# EAGLE design cummins_controller_V1.4 (EAGLE 9.3.0)
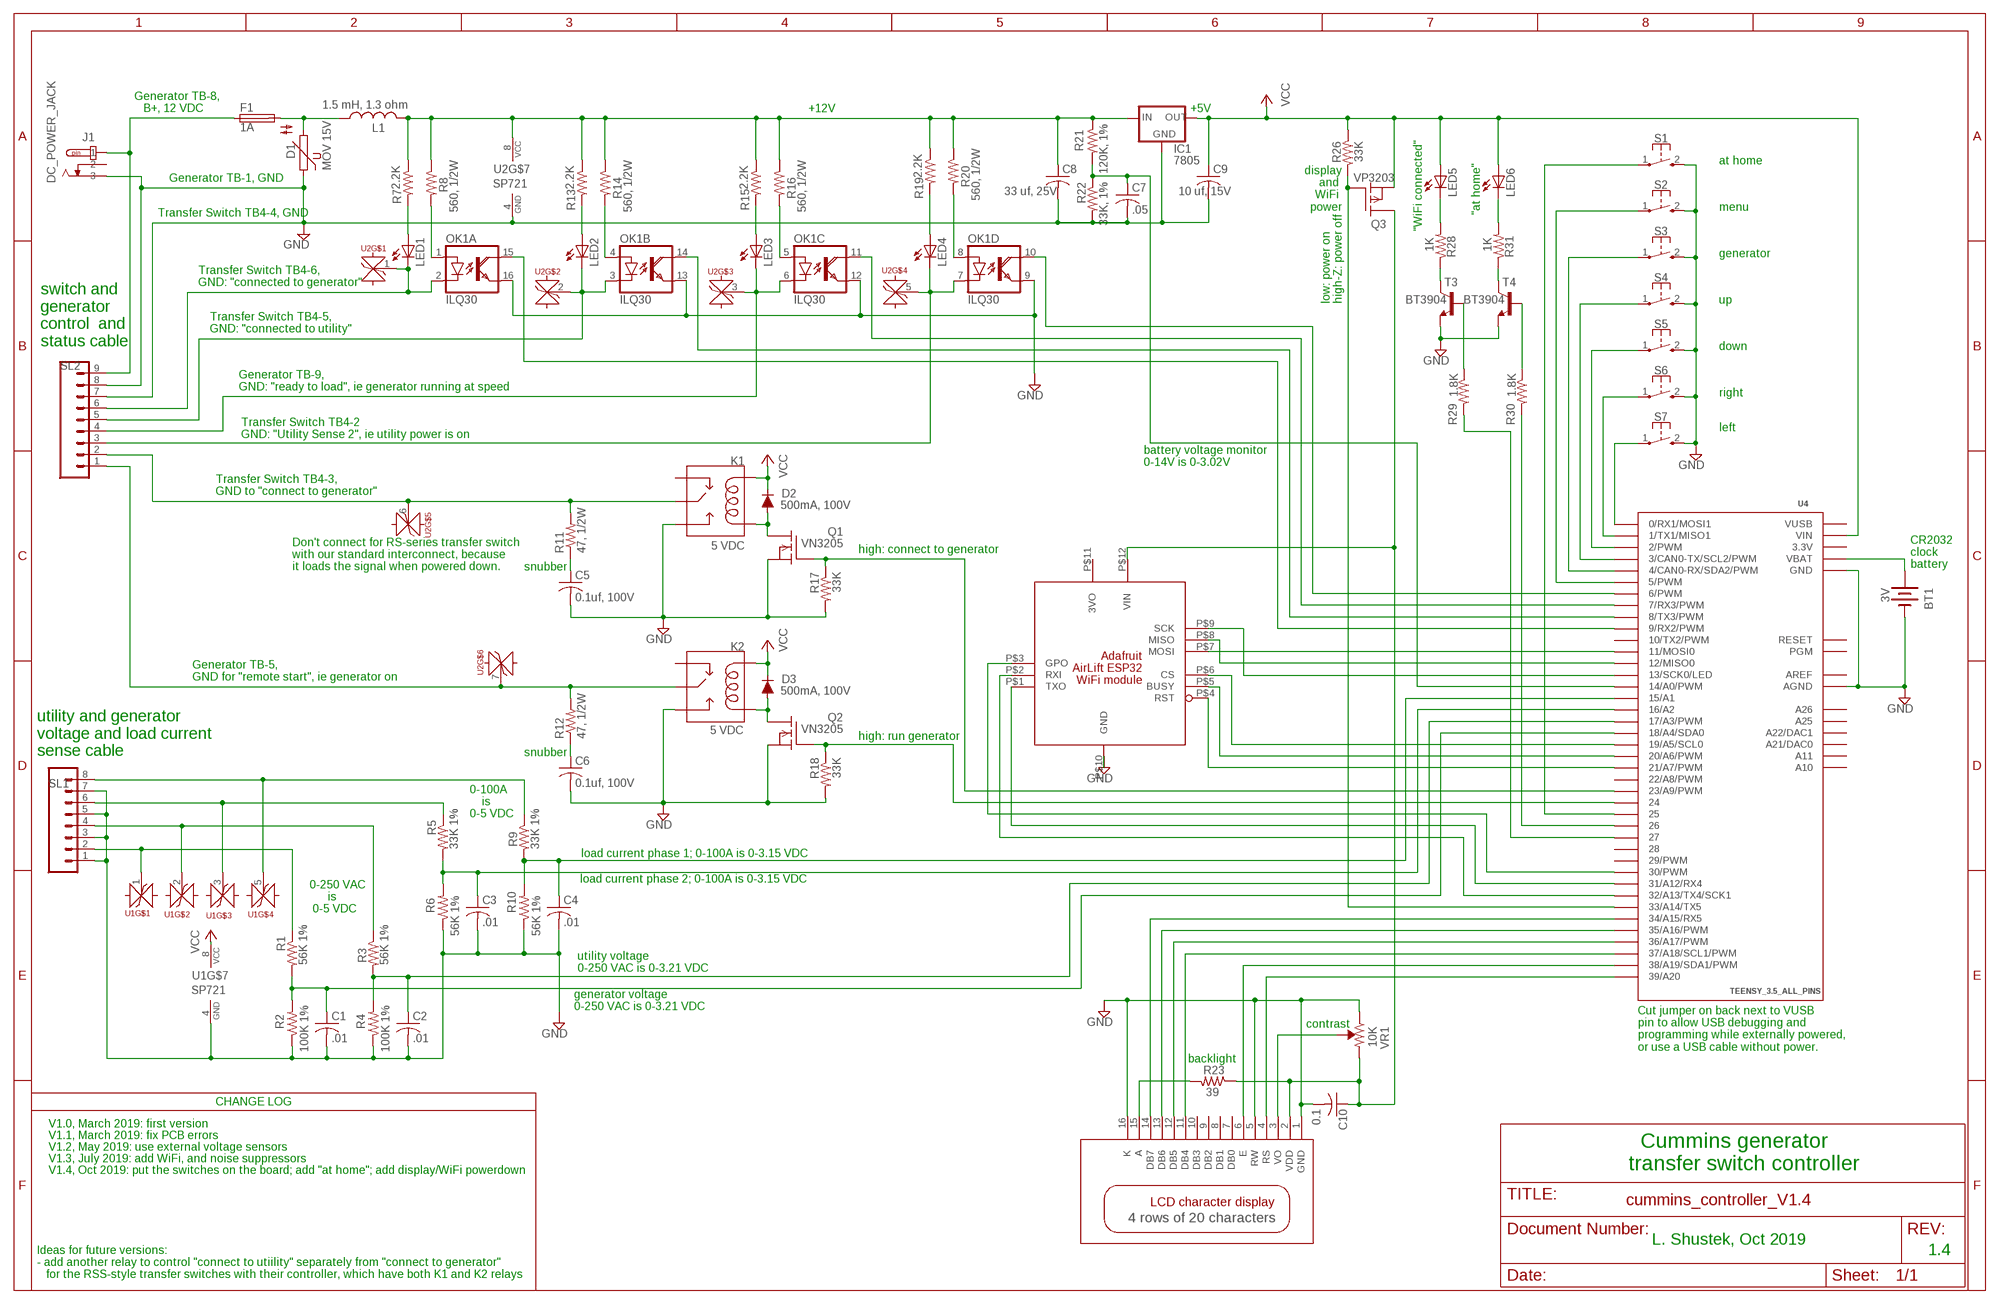
[diagram p0: schematic, sheet 1]

## Parts
BT1  3V  BATTERY-20MM_PTH  [BATTCOM_20MM_PTH]
C1  .01  C-USC0805K  [C0805K]
C2  .01  C-USC0805K  [C0805K]
C3  .01  C-USC0805K  [C0805K]
C4  .01  C-USC0805K  [C0805K]
C5  0.1uf, 100V  C-USC1210K  [C1210K]
C6  0.1uf, 100V  C-USC1210K  [C1210K]
C7  .05  C-USC0805K  [C0805K]
C8  33 uf, 25V  C-USC3216  [C3216]
C9  10 uf, 15V  C-USC1210K  [C1210K]
C10  0.1  C-USC0805K  [C0805K]
D1  MOV 15V  S14K230  [S14K230]
D2  500mA, 100V  DIODE-BAS16J  [SOD-323]
D3  500mA, 100V  DIODE-BAS16J  [SOD-323]
F1  1A  FUSEPICOFUSE  [PICOFUSE]
IC1  7805  78XXS  [78XXS]
J1  DC_POWER_JACK  [DC_POWER_JACK]
K1  5 VDC  RELAY-SPDT-V2  [RELAY-PANASONIC-JS]
K2  5 VDC  RELAY-SPDT-V2  [RELAY-PANASONIC-JS]
L1  1.5 mH, 1.3 ohm  INDUCTOR  [INDUCTOR_1.1IN]
LED1  LED5MM  [LED5MM]
LED2  LED5MM  [LED5MM]
LED3  LED5MM  [LED5MM]
LED4  LED5MM  [LED5MM]
LED5  LED5MM  [LED5MM]
LED6  LED5MM  [LED5MM]
OK1  ILQ30  [DIL16]
Q1  VN3205  VN3205SOT89  [SOT89]
Q2  VN3205  VN3205SOT89  [SOT89]
Q3  VP3203  VP3203SOP89  [SOT89]
R1  56K 1%  R-US_M1206  [M1206]
R2  100K 1%  R-US_M1206  [M1206]
R3  56K 1%  R-US_M1206  [M1206]
R4  100K 1%  R-US_M1206  [M1206]
R5  33K 1%  R-US_M1206  [M1206]
R6  56K 1%  R-US_M1206  [M1206]
R7  2.2K  R-US_M1206  [M1206]
R8  560, 1/2W  R-US_R1210  [R1210]
R9  33K 1%  R-US_M1206  [M1206]
R10  56K 1%  R-US_M1206  [M1206]
R11  47, 1/2W  R-US_R1210  [R1210]
R12  47, 1/2W  R-US_R1210  [R1210]
R13  2.2K  R-US_M1206  [M1206]
R14  560, 1/2W  R-US_R1210W  [R1210W]
R15  2.2K  R-US_M1206  [M1206]
R16  560, 1/2W  R-US_R1210  [R1210]
R17  33K  R-US_M1206  [M1206]
R18  33K  R-US_M1206  [M1206]
R19  2.2K  R-US_M1206  [M1206]
R20  560, 1/2W  R-US_R1210  [R1210]
R21  120K, 1%  R-US_M1206  [M1206]
R22  33K, 1%  R-US_M1206  [M1206]
R23  39  R-US_M1206  [M1206]
R26  33K  R-US_M1206  [M1206]
R28  1K  R-US_M1206  [M1206]
R29  1.8K  R-US_M1206  [M1206]
R30  1.8K  R-US_M1206  [M1206]
R31  1K  R-US_M1206  [M1206]
S1  PUSHBUTTON-SPST  [PUSHBUTTON-SPST]
S2  PUSHBUTTON-SPST  [PUSHBUTTON-SPST]
S3  PUSHBUTTON-SPST  [PUSHBUTTON-SPST]
S4  PUSHBUTTON-SPST  [PUSHBUTTON-SPST]
S5  PUSHBUTTON-SPST  [PUSHBUTTON-SPST]
S6  PUSHBUTTON-SPST  [PUSHBUTTON-SPST]
S7  PUSHBUTTON-SPST  [PUSHBUTTON-SPST]
SL1  M08  [08P]
SL2  M09  [09P]
T3  BT3904  NPN-TRANSISTORSOT23-3  [SOT23-3]
T4  BT3904  NPN-TRANSISTORSOT23-3  [SOT23-3]
U1  SP721  TVS_DIODE_ARRAY  [TVS_6DIODE_ARRAY]
U2  SP721  TVS_DIODE_ARRAY  [TVS_6DIODE_ARRAY]
U3  ADAFRUIT_AIRLIFT_ESP32  [ADAFRUIT_AIRLIFT_ESP32]
U4  TEENSY_3.5_ALL_PINS  [TEENSY_3.5_ALL_PINS]
VR1  10K  TRIMPOT  [TRIMBOT-BOURNS-3362M]
X1  4 rows of 20 characters  LCD-CHARACTER-DISPLAY  [LCD-CHARACTER-DISPLAY-20X4]

## Nets
GND [power]: BT1.2(-) C1.2 C2.2 C3.2 C4.2 C5.2 C6.2 C7.2 C8.2 C9.2 C10.2 D1.1 IC1.GND J1.P$5 K1.P$3(NO) K2.P$3(NO) OK1.9(D:EMI) OK1.12(C:EMI) OK1.13(B:EMI) OK1.16(A:EMI) Q1.3(S) Q2.3(S) R2.1 R4.1 R6.1 R10.1 R17.2 R18.2 R22.2 S1.2 S2.2 S3.2 S4.2 S5.2 S6.2 S7.2 SL1.1 SL1.3 SL1.5 SL1.7 SL2.7 SL2.8 T3.2(E) T4.2(E) U1.4(GND) U2.4(GND) U3.P$10(GND) U4.AGND U4.GND U4.GND1(GND) U4.GND3(GND) U4.GND4(GND) U4.GND6(GND) VR1.3(CW) X1.1(GND) X1.5(RW) X1.16(K)
N$1: BT1.1(+) U4.VBAT
N$2 [power]: D2.A K1.P$5(COIL2) Q1.2(D) Q1.2@1(D)
N$3: S7.1 U4.0(0/RX1/MOSI1)
N$4: LED1.A R7.2
N$5: R9.1 SL1.8 U1.5
N$6 [power]: D3.A K2.P$5(COIL2) Q2.2(D) Q2.2@1(D)
N$7: U3.P$1(TXO) U4.31/A12(31/A12/RX4)
N$8 [power]: LED2.K(C) OK1.3(B:C) SL2.5 U2.2
N$9 [power]: F1.1 J1.P$1 SL2.9
N$10: LED2.A R13.2
N$11 [power]: K2.P$1(MAIN) R12.2 SL2.1 U2.7
N$12 [power]: K1.P$1(MAIN) R11.2 SL2.2 U2.6
N$13: LED3.A R15.2
N$14: Q2.1(G) R18.1 U4.24
N$15: C4.1 R9.2 R10.2 U4.15/A1
N$16: R5.1 SL1.6 U1.3
N$17: C3.1 R5.2 R6.2 U4.16/A2
N$18: R3.1 SL1.4 U1.2
N$19: C2.1 R3.2 R4.2 U4.17/A3(17/A3/PWM)
N$20: LED4.A R19.2
N$21: OK1.5(C:A) R16.2
N$22: R1.1 SL1.2 U1.1
N$23: R30.1 T4.1(B)
N$24 [power]: LED1.K(C) OK1.2(A:C) SL2.6 U2.1
N$25: C1.1 R1.2 R2.2 U4.18/A4(18/A4/SDA0)
N$26: U3.P$9(SCK) U4.13(13/SCK0/LED)
N$27: U3.P$8(MISO) U4.12(12/MISO0)
N$28: U3.P$7(MOSI) U4.11(11/MOSI0)
N$29: U3.P$6(CS) U4.19/A5(19/A5/SCL0)
N$30: U3.P$5(BUSY) U4.20/A6(20/A6/PWM)
N$31: U3.P$4(RST) U4.21/A7(21/A7/PWM)
N$32: U3.P$2(RXI) U4.32/A13(32/A13/TX4/SCK1)
N$33: U4.34/A15(34/A15/RX5) X1.14(DB7)
N$34: R31.1 T4.3(C)
N$35: U4.39/A20 X1.4(RS)
N$36: U4.38/A19(38/A19/SDA1/PWM) X1.6(E)
N$37 [power]: LED3.K(C) OK1.6(C:C) SL2.4 U2.3
N$38: U4.37/A18(37/A18/SCL1/PWM) X1.11(DB4)
N$39: U4.36/A17(36/A17/PWM) X1.12(DB5)
N$40: U4.35/A16(35/A16/PWM) X1.13(DB6)
N$41: Q1.1(G) R17.1 U4.23/A9(23/A9/PWM)
N$42 [power]: C8.1 IC1.IN L1.P$2 R7.1 R8.1 R13.1 R14.1 R15.1 R16.1 R19.1 R20.1 R21.1 U2.8(VCC)
N$43: S6.1 U4.1(1/TX1/MISO1)
N$44: S5.1 U4.2(2/PWM)
N$45: S4.1 U4.3(3/CAN0-TX/SCL2/PWM)
N$46: S3.1 U4.4(4/CAN0-RX/SDA2/PWM)
N$47: S2.1 U4.5(5/PWM)
N$48: VR1.2(WIPER) X1.3(VO)
N$49: R23.2 X1.15(A)
N$50: S1.1 U4.25
N$51: LED5.K(C) R28.2
N$52 [power]: OK1.10(D:COL) U4.6(6/PWM)
N$53 [power]: OK1.11(C:COL) U4.7(7/RX3/PWM)
N$54 [power]: OK1.14(B:COL) U4.8(8/TX3/PWM)
N$55 [power]: OK1.15(A:COL) U4.9(9/RX2/PWM)
N$56: C5.1 R11.1
N$57: C6.1 R12.1
N$58: OK1.1(A:A) R8.2
N$59 [power]: LED4.K(C) OK1.7(D:C) SL2.3 U2.5
N$60: OK1.4(B:A) R14.2
N$61: LED6.K(C) R31.2
N$62: OK1.8(D:A) R20.2
N$63: C7.1 R21.2 R22.1 U4.14/A0(14/A0/PWM)
N$64: Q3.1(G) R26.2 U4.33/A14(33/A14/TX5)
N$65: U3.P$3(GPO) U4.30(30/PWM)
N$66: R29.1 T3.1(B)
N$67: R28.1 T3.3(C)
N$68: R29.2 U4.27
N$70 [power]: D1.2 F1.2 L1.P$1
N$72: R30.2 U4.26
VCC [power]: C9.1 D2.C D3.C IC1.OUT K1.P$2(COIL1) K2.P$2(COIL1) LED5.A LED6.A Q3.3(S) R26.1 U1.8(VCC) U4.VIN
VDD [power]: C10.1 Q3.2(D) Q3.2@1(D) R23.1 U3.P$12(VIN) VR1.1(CCW) X1.2(VDD)
Unconnected: J1.P$3 K1.P$4(NC) K2.P$4(NC) U1.6 U1.7 U3.P$11(3VO) U4.10(10/TX2/PWM) U4.22/A8(22/A8/PWM) U4.28 U4.29(29/PWM) U4.A10 U4.A11 U4.A21(A21/DAC0) U4.A22(A22/DAC1) U4.A25 U4.A26 U4.PGM U4.RESET X1.7(DB0) X1.8(DB1) X1.9(DB2) X1.10(DB3)

## Notes on the sheet
- Generator TB-8,
     B+, 12 VDC
- +12V | +5V
- "WiFi connected"
- "at home" | at home
- Generator TB-1, GND
- display
   and 
  WiFi 
  power
- menu
- Transfer Switch TB4-4, GND
- generator
- Transfer Switch TB4-6, 
  GND: "connected to generator"
- low: power on
  high-Z: power off
- up
- Transfer Switch TB4-5, 
  GND: "connected to utility"
- switch and 
  generator
  control  and
  status cable
- down
- Generator TB-9,
  GND: "ready to load", ie generator running at speed
- right
- left
- Transfer Switch TB4-2
  GND: "Utility Sense 2", ie utility power is on
- battery voltage monitor
  0-14V is 0-3.02V
- Transfer Switch TB4-3, 
  GND to "connect to generator"
- high: connect to generator
- CR2032
  clock
  battery
- Don't connect for RS-series transfer switch
  with our standard interconnect, because
  it loads the signal when powered down.
- snubber
- Generator TB-5,
  GND for "remote start", ie generator on
- high: run generator
- utility and generator
  voltage and load current
  sense cable
- snubber
- 0-100A
      is 
  0-5 VDC
- load current phase 1; 0-100A is 0-3.15 VDC
- load current phase 2; 0-100A is 0-3.15 VDC
- 0-250 VAC
        is 
   0-5 VDC
- utility voltage
  0-250 VAC is 0-3.21 VDC
- generator voltage
  0-250 VAC is 0-3.21 VDC
- contrast
- Cut jumper on back next to VUSB
  pin to allow USB debugging and 
  programming while externally powered,
  or use a USB cable without power.
- backlight
- CHANGE LOG
- V1.0, March 2019: first version
- V1.1, March 2019: fix PCB errors
- V1.2, May 2019: use external voltage sensors
- V1.3, July 2019: add WiFi, and noise suppressors
- Cummins generator 
  transfer switch controller
- V1.4, Oct 2019: put the switches on the board; add "at home"; add display/WiFi powerdown
- L. Shustek, Oct 2019
- 1.4
- Ideas for future versions:
  - add another relay to control "connect to utiility" separately from "connect to generator"
     for the RSS-style transfer switches with their controller, which have both K1 and K2 relays

## Power pins joined to a net without a drawn wire
3.3V: U4.3.3V U4.3.3V3(3.3V) U4.3.3V4(3.3V)
AREF: U4.AREF
VUSB: U4.VUSB

## Library data of the parts
BT1 = SparkFun-Batteries:BATTERY: Battery - Single Cell A variety of battery chemistries, sizes, and footprints. Device List: 20MM_PTH - Coin Cell Battery Holder - 20mm (PTH) <https://www.sparkfun.com/products/783> 6.8MM_PTH - Coin Cell Battery Holder - 6.8MM(SMD) <https://www.digikey.com/product-detail/en/seiko-instruments/MS621FE-FL11E/728-1057-ND/1889208?WT.srch=1&gclid=CNOQ5a6LzdQCFZS2wAodXCkE0g> 12MM_SMD - Coin Cell Battery Holder - 12mm (SMD) <https://www.sparkfun.com/products/10592> 12MM_PTH - Coin Cell Battery Holder - 12mm (PTH) <https://www.sparkfun.com/products/7948> 20MM_SMD - 20mm Coin Cell Battery Holder (SMD) (2 legs) Used on the Big Time Watch Kit <https://www.sparkfun.com/products/11734> 20MM_SMD_4LEGS - Coin Cell Battery Holder - 20mm (SMD) <https://www.sparkfun.com/products/11892> 20MM_SMD_4LEGS_OVERPASTE - Coin Cell Battery Holder - 20mm (SMD) <https://www.sparkfun.com/products/11892> (Over-paste on the legs) 24.5MM_PTH - Coin Cell Battery Holder - 24.5mm (PTH) <https://www.sparkfun.com/products/8863> 9V - 9V Battery Holder - PC Mount Used on the SparkFun SparkPunk Sound Kit <https://www.sparkfun.com/products/11177> and SparkFun SparkPunk Sequencer Kit <https://www.sparkfun.com/products/12707> 18650 - Battery Holder - 18650 (PTH) <https://www.sparkfun.com/products/13113> AA - Battery Holder - 1xAA (PTH) <https://www.sparkfun.com/products/7949> AAA - Battery Holder - 1xAAA (PTH) <https://www.sparkfun.com/products/12718> AA_KIT - Battery Holder - 1xAA (PTH) <https://www.sparkfun.com/products/7949> Special kit package - pads only have exposed copper on one side of the board. AAA_KIT - Battery Holder - 1xAAA (PTH) <https://www.sparkfun.com/products/12718> Special kit package - pads only have exposed copper on one side of the board.; PROD_ID: BATT-09031; SF_SKU: PRT-00783
C1-C4 C7 C10 = adafruit:C-US: CAPACITOR, American symbol
C5 C6 C8 C9 = resistor:C-US: CAPACITOR, American symbol
D1 = varistor:S14K230: VARISTOR
D2 D3 = SparkFun-DiscreteSemi:DIODE: Diode These are standard reverse protection diodes and small signal diodes. SparkFun Products: SparkFun SparkPunk Sound Kit <https://www.sparkfun.com/products/11177> SparkFun ESP8266 Thing <https://www.sparkfun.com/products/13231>; PROD_ID: DIO-09646; VALUE: 250mA/100V
F1 = fuse:FUSE: Fuse; OC_FARNELL: unknown; OC_NEWARK: unknown
IC1 = v-reg:78XXS: VOLTAGE REGULATOR
J1 = Len:DC_POWER_JACK: DC POWER JACK Source: DCJ0202.pdf; OC_FARNELL: unknown; OC_NEWARK: unknown
K1 K2 = Len:RELAY-SPDT-V2: SPDT Electromechanical Relay Single-pole, double-throw sealed relays. When current is applied to the coil, it throws a simple changeover switch, terminating the connection from the NC contact to ground and closing the NO contact. Use them to switch high voltage/high current devices. SparkFun Products JQX-15F: Relay SPDT Sealed - 20A <https://www.sparkfun.com/products/10924> (COM-10924) JZC-11F: Relay SPDT Sealed <https://www.sparkfun.com/products/100> (COM-00100)
L1 = Len:INDUCTOR
LED1-LED6 = adafruit:LED: LED OSRAM: - CHIPLED LG R971, LG N971, LY N971, LG Q971, LY Q971, LO R971, LY R971 LH N974, LH R974 LS Q976, LO Q976, LY Q976 LO Q996 - Hyper CHIPLED LW Q18S LB Q993, LB Q99A, LB R99A - SideLED LS A670, LO A670, LY A670, LG A670, LP A670 LB A673, LV A673, LT A673, LW A673 LH A674 LY A675 LS A676, LA A676, LO A676, LY A676, LW A676 LS A679, LY A679, LG A679 - Hyper Micro SIDELED® LS Y876, LA Y876, LO Y876, LY Y876 LT Y87S - SmartLED LW L88C, LW L88S LB L89C, LB L89S, LG L890 LS L89K, LO L89K, LY L89K LS L896, LA L896, LO L896, LY L896 - TOPLED LS T670, LO T670, LY T670, LG T670, LP T670 LSG T670, LSP T670, LSY T670, LOP T670, LYG T670 LG T671, LOG T671, LSG T671 LB T673, LV T673, LT T673, LW T673 LH T674 LS T676, LA T676, LO T676, LY T676, LB T676, LH T676, LSB T676, LW T676 LB T67C, LV T67C, LT T67C, LS T67K, LO T67K, LY T67K, LW E67C LS E67B, LA E67B, LO E67B, LY E67B, LB E67C, LV E67C, LT E67C LW T67C LS T679, LY T679, LG T679 LS T770, LO T770, LY T770, LG T770, LP T770 LB T773, LV T773, LT T773, LW T773 LH T774 LS E675, LA E675, LY E675, LS T675 LS T776, LA T776, LO T776, LY T776, LB T776 LHGB T686 LT T68C, LB T68C - Hyper Mini TOPLED® LB M676 - Mini TOPLED Santana® LG M470 LS M47K, LO M47K, LY M47K Source: http://www.osram.convergy.de/
OK1 = optocoupler:ILQ30: SIEMENS OPTO COUPLER; MF: VISHAY/TELEFUNKEN; MPN: ILQ30; OC_FARNELL: 1612449; OC_NEWARK: 58K1688
Q1 Q2 = Len:VN3205: N-Channel Enhancement MOSFET 500V, 0.4A, 6.0 Ohm
Q3 = Len:VP3203: P-Channel Enhancement MOSFET (HEXFET); -100V; -12A; 0,3Ohm
R1-R13 R15-R23 R26 R28-R31 = resistor:R-US_: RESISTOR, American symbol
R14 = adafruit:R-US_: RESISTOR, American symbol
S1-S7 = Len:PUSHBUTTON-SPST: Momentary Switch (Pushbutton) - SPST - Two Circuits Normally-open (NO) SPST momentary switches
SL1 = con-amp-quick:M08: AMP QUICK CONNECTOR; OC_FARNELL: unknown; OC_NEWARK: unknown
SL2 = con-amp-quick:M09: AMP QUICK CONNECTOR; OC_FARNELL: unknown; OC_NEWARK: unknown
T3 T4 = Len:NPN-TRANSISTOR
U1 U2 = Len:TVS_DIODE_ARRAY
U3 = Len:ADAFRUIT_AIRLIFT_ESP32: Adafruit AirLink ESP32 WiFi module
U4 = Teensy_3_and_LC_Series_Boards_v1.4:TEENSY_3.5_ALL_PINS: All PIN version of the Teensy 3.5. Note: the NC pin is not shown in symbol package, not connected here either.
VR1 = Len:TRIMPOT: Trimming Potentiometer (Trimpot) Three-terminal potentiometers, with an adjustable wiper and two adjustable resistors. A pot can be used to create a configurable voltage divider, or as a variable resistor. "Trimpots" are a subset of potentiometers, usually intended for "set-and-forget" applications. They're often more delicate than standard potentiometers - rated for fewer turns. Variants PTH-KNOB - PTH Trimpot w/ finger-adjustable knob Trimpot 10K with Knob <https://www.sparkfun.com/products/9806> (COM-09806) Datasheet <http://www.sparkfun.com/datasheets/Components/General/TSR-3386.pdf> SMD-3MM-CLOSED-FRAME - SMD 3mm Square Closed-Frame Trimpot Used on e.g. EasyDriver - Stepper Motor Driver <https://www.sparkfun.com/products/12779> Datasheet <http://www.bitechnologies.com/pdfs/22.pdf> (22AR10KTR) SMD-5MM - SMD 5mm Square Closed-Frame Trimpot Used on e.g. IOIO-OTG - V2.2 <https://www.sparkfun.com/products/13613> Datasheet <http://www.vishay.com/docs/51008/ts53.pdf> (TS53YL502MR10) SMD-3MM-1/10W-25% - 3mm Square Open-Frame Trimpot Used on e.g. SparkFun Shapeoko <https://www.sparkfun.com/products/13899> Datasheet <http://www.bourns.com/docs/Product-Datasheets/TC33.pdf> (TC33X-2-103E)
X1 = Len:LCD-CHARACTER-DISPLAY: HD44780 LCD Standard character type LCDs, available in sizes from 8x1 to 40x4!

## Net classes
0 default: width 0.381 mm
1 power: width 0.508 mm
2 highV: width 0.508 mm

## Board
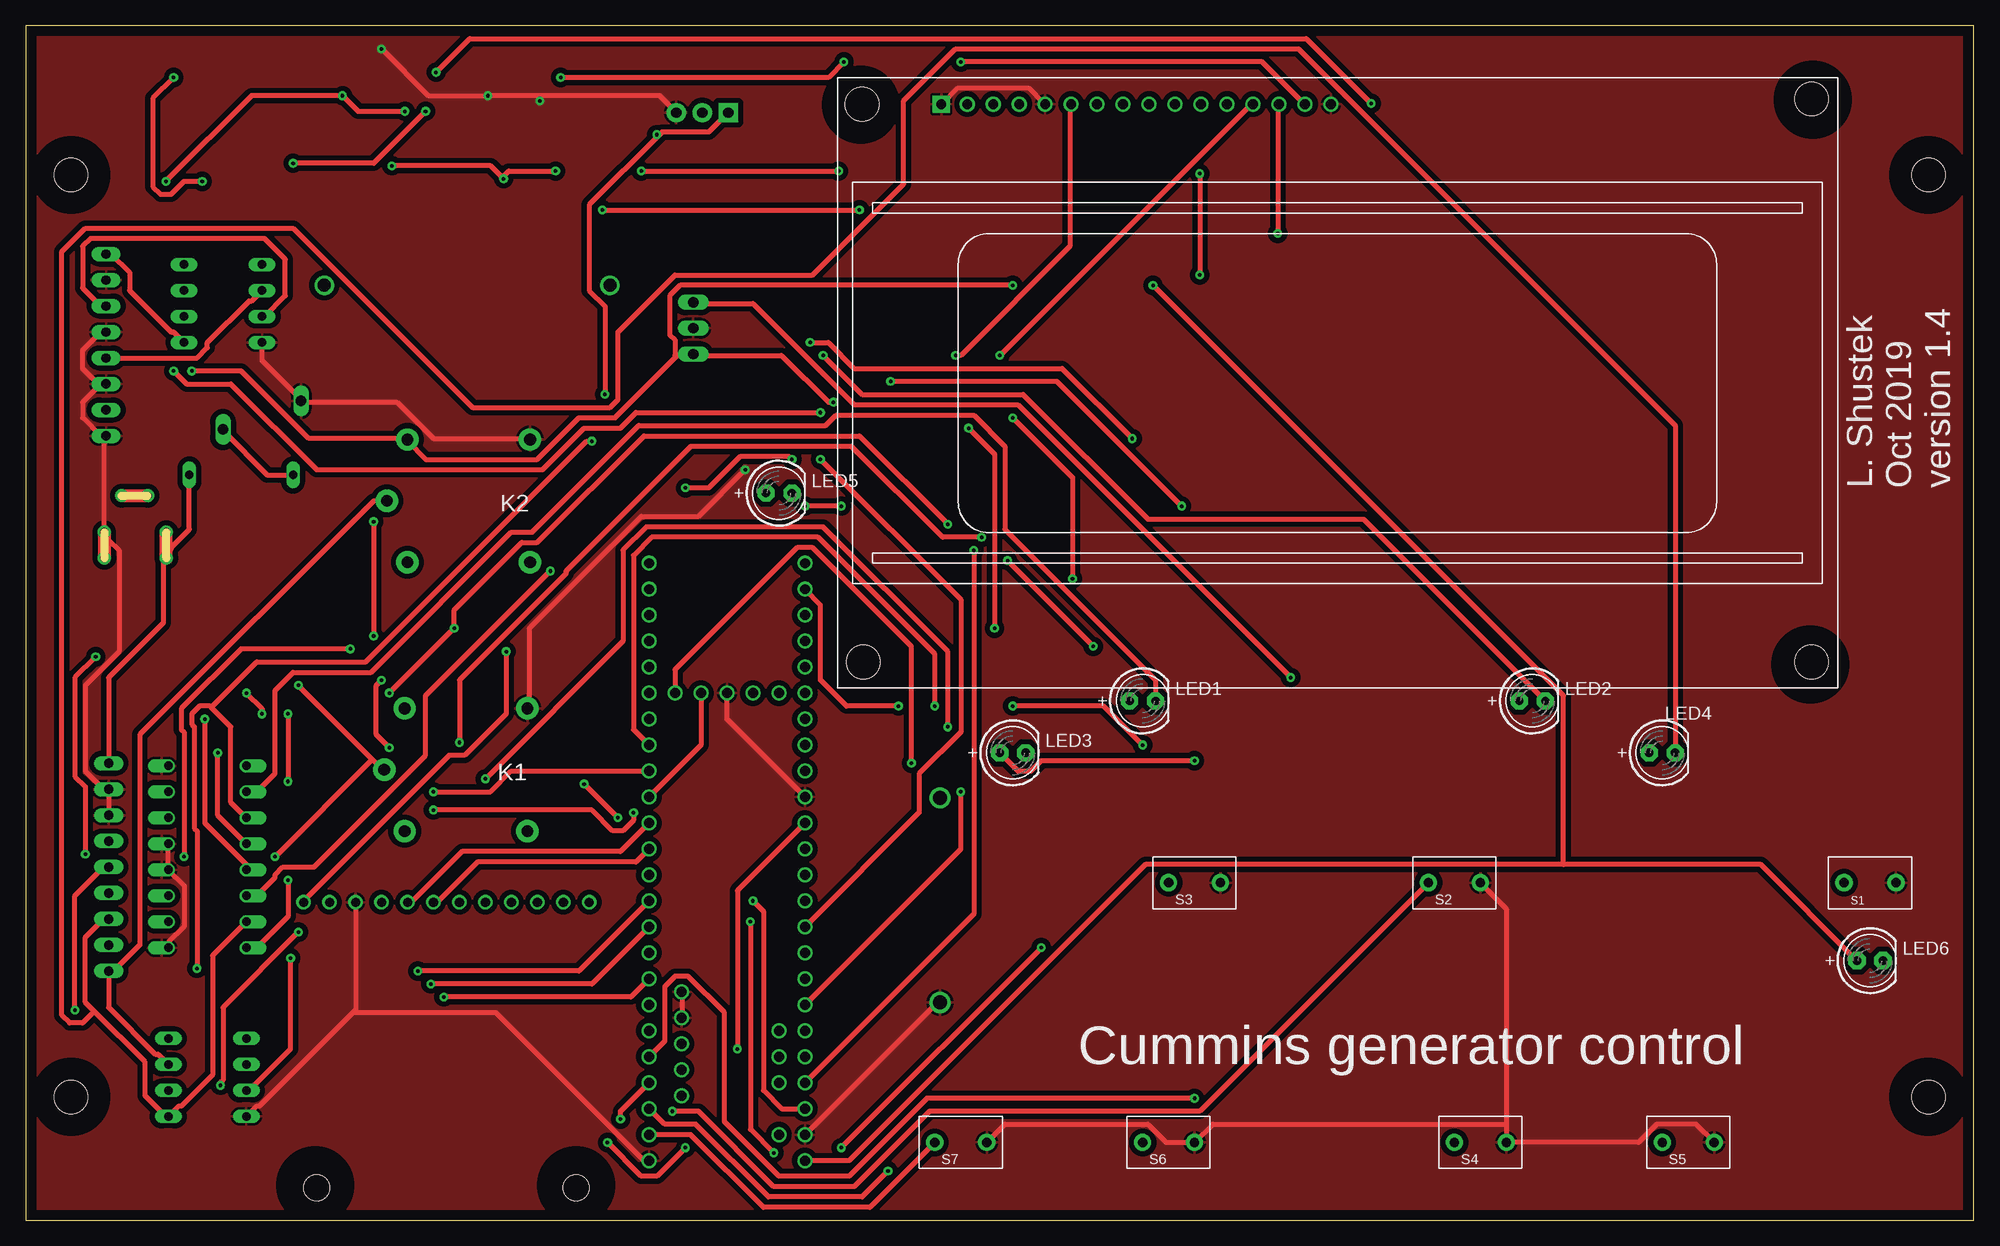
[diagram p1: board, top side]
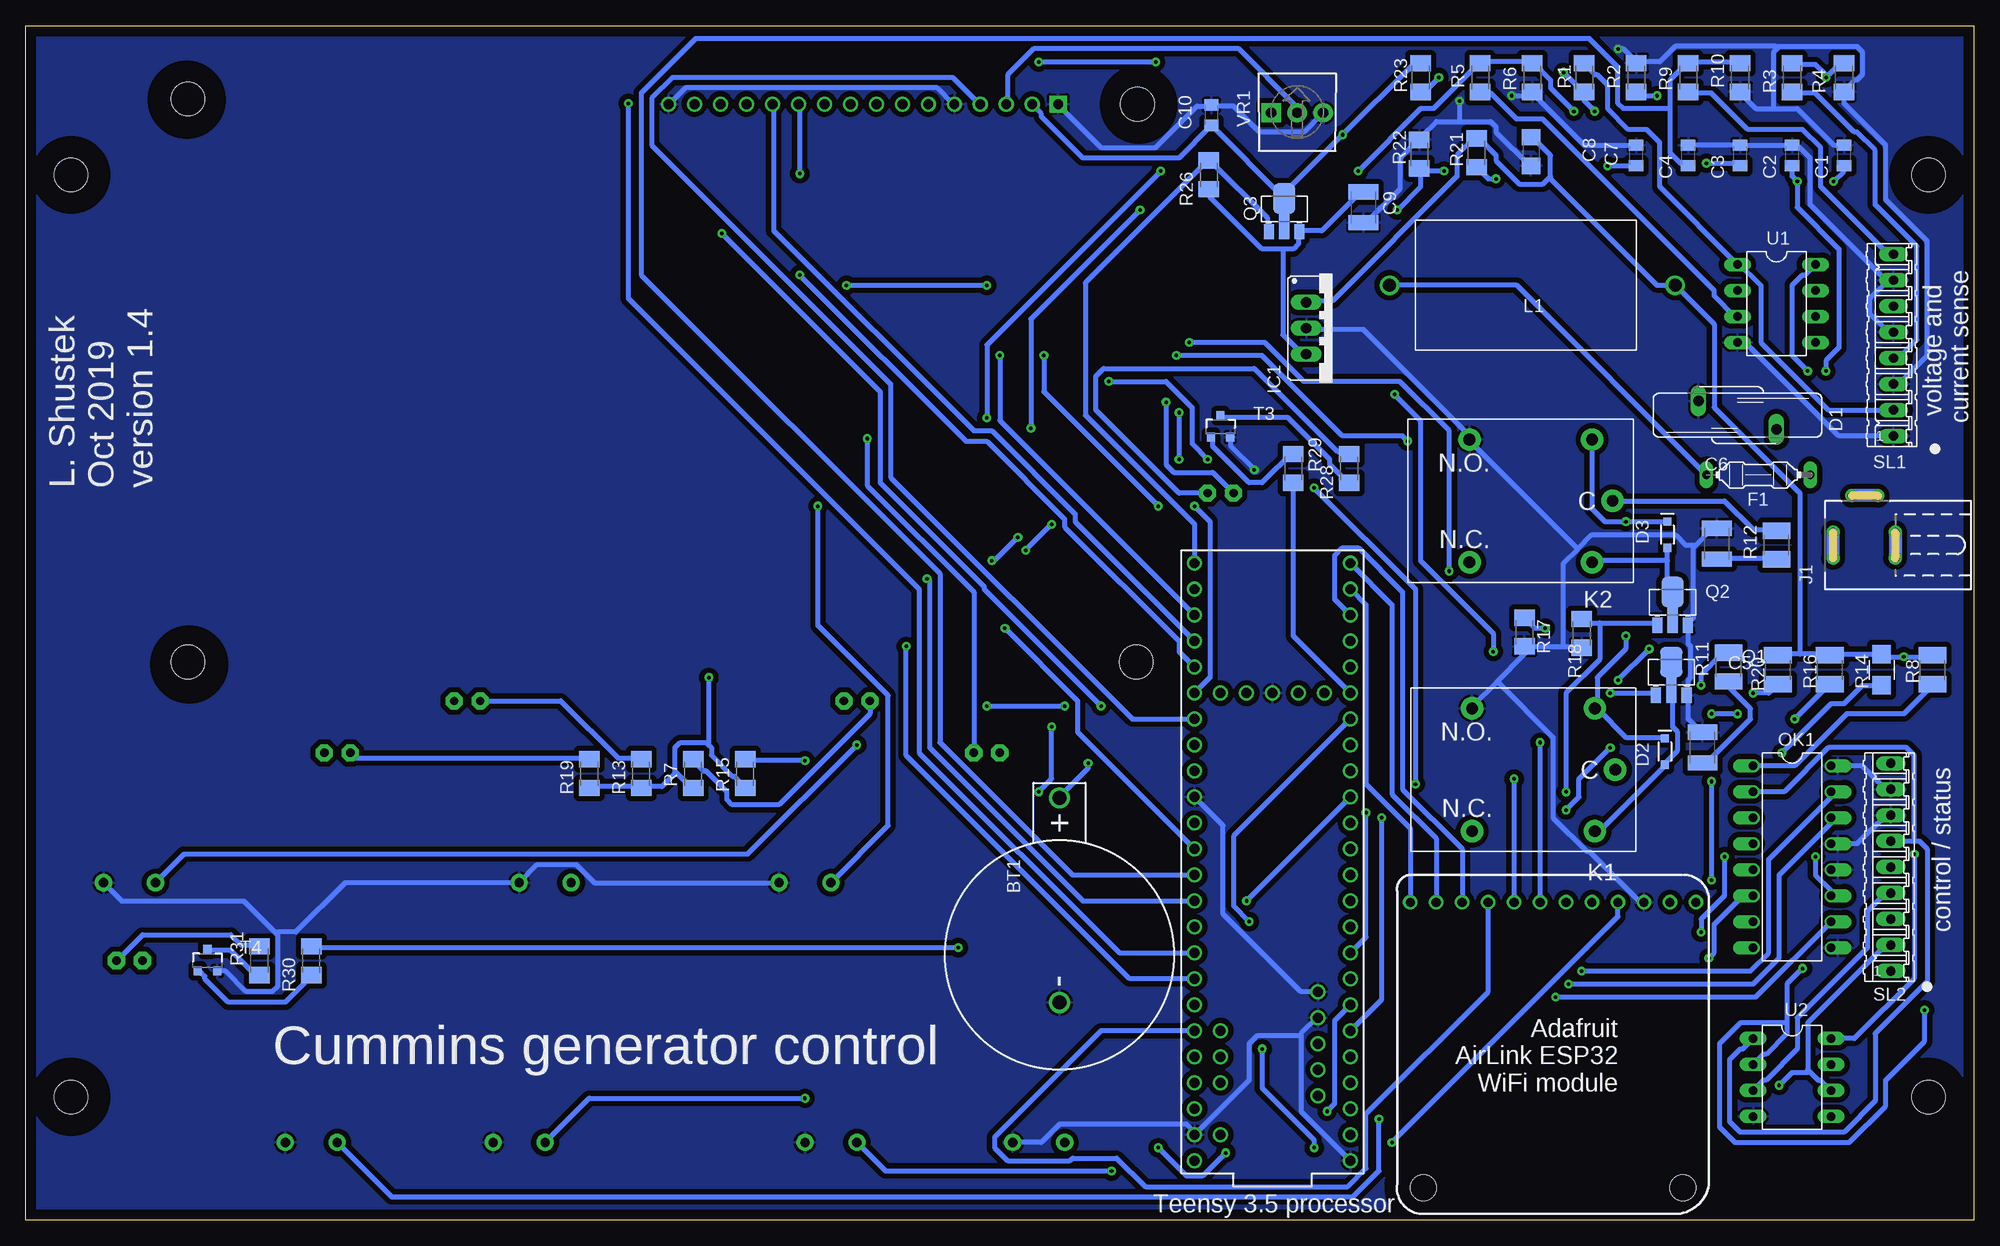
[diagram p2: board, bottom side, seen from below]

Size 190.5 x 116.84 mm. Coordinates in mm from the lower left corner, seen from the top.
Outline: 0,0 190.5,0 190.5,116.84 0,116.84 0,0
Copper layers (1*16): Top 0.035mm / dielectric 1.5mm / Bottom 0.035mm
Design rules "Eagle_design_rules *": minimum track width 20mil, minimum drill 0.35mm, track to track 20mil, track to pad 20mil, pad to pad 15mil, via to via 20mil, smd to smd 15mil, copper to edge 40mil, drill to drill 12mil, minimum pad ring 10mil, minimum via ring 10mil, stop-mask expansion 4mil, vias tented up to drill 0mil, thermal gap 10mil
Holes 3.3 mm at 4.45,12.07 4.45,102.23 186.06,12.07 186.06,102.23
tRestrict: area 0.6,8.3 to 8.3,15.9; area 0.6,98.4 to 8.3,106; area 182.2,98.4 to 189.9,106; area 182.2,8.3 to 189.9,15.9; area 78.1,50.7 to 85.7,58.3; area 170.7,50.5 to 178.3,58.2; area 170.9,105.8 to 178.6,113.4; area 77.9,105.3 to 85.5,112.9; area 50,-0.4 to 57.7,7.2; area 24.5,-0.4 to 32.1,7.2
bRestrict: area 0.6,8.3 to 8.3,15.9; area 0.6,98.4 to 8.3,106; area 182.2,98.4 to 189.9,106; area 182.2,8.3 to 189.9,15.9; area 78,50.7 to 85.6,58.3; area 170.7,50.5 to 178.3,58.2; area 170.9,105.8 to 178.6,113.4; area 77.9,105.3 to 85.5,112.9; area 24.4,-0.4 to 32,7.2; area 50,-0.5 to 57.7,7.1
vRestrict: area 0.6,8.3 to 8.3,15.9; area 0.6,98.4 to 8.3,106; area 182.2,98.4 to 189.9,106; area 182.2,8.3 to 189.9,15.9; area 65.9,6.2 to 73.5,13.8; area 65.9,31.8 to 73.5,39.4; area 77.5,50.5 to 85.1,58.2; area 170.3,50.4 to 177.9,58; area 170.3,105.5 to 177.9,113.2; area 77.5,105 to 85.1,112.6

### Footprints (pad centres in the part's own frame; a part is rotated, then mirrored left to right if it is on the bottom)
BATTCOM_20MM_PTH = drill 1.397: 1 11.85,0; 2 -8.15,0
C0805K = smd 1.1 x 1.4: 1 -1,0; 2 1,0
C1210K = smd 1.5 x 2.9: 1 -1.5,0; 2 1.5,0
C3216 = smd 1.6 x 1.8: 1 -1.4,0; 2 1.4,0
S14K230 = drill 1.016 long: 1 -1.397,-3.81; 2 1.397,3.81
SOD-323 = smd 0.813 x 0.813: A 1.277,0; C -1.277,0
PICOFUSE = drill 0.813 long: 1 -5.08,0; 2 5.08,0
78XXS = drill 1.016 long: GND 0,-2.54; IN -2.54,-2.54; OUT 2.54,-2.54
DC_POWER_JACK = drill 0.762: P$1 -1.27,3.099; P$2 1.27,3.099; P$3 4.826,-1.27; P$4 4.826,1.27; P$5 1.27,-2.972; P$6 -1.27,-2.972
RELAY-PANASONIC-JS = drill 1.143 pad 2.184: P$1 -9,0; P$2 -7,-6; P$3 5,-6; P$4 5,6; P$5 -7,6
INDUCTOR_1.1IN = drill 1.27: P$1 -13.97,0; P$2 13.97,0
LED5MM = drill 0.813 pad 1.676 octagon: A -1.27,0; K 1.27,0
DIL16 = drill 0.813 offset: 1 -8.89,-3.81; 2 -6.35,-3.81; 3 -3.81,-3.81; 4 -1.27,-3.81; 5 1.27,-3.81; 6 3.81,-3.81; 7 6.35,-3.81; 8 8.89,-3.81; 9 8.89,3.81; 10 6.35,3.81; 11 3.81,3.81; 12 1.27,3.81; 13 -1.27,3.81; 14 -3.81,3.81; 15 -6.35,3.81; 16 -8.89,3.81
SOT89 = smd 1 x 1.5: 1 -1.5,-2; 3 1.5,-2 | smd 1 x 5.5: 2 0,0 | smd 2.2 x 3: 2@1 0,1.25
M1206 = smd 1.6 x 2: 1 -1.4,0; 2 1.4,0
R1210 = smd 1.6 x 2.7: 1 -1.4,0; 2 1.4,0
R1210W = smd 1.8 x 1.8: 1 -1.499,0; 2 1.499,0
PUSHBUTTON-SPST = drill 0.9 pad 1.676: 1 -2.54,0; 2 2.54,0
08P = drill 0.914 long: 1 -8.89,0; 2 -6.35,0; 3 -3.81,0; 4 -1.27,0; 5 1.27,0; 6 3.81,0; 7 6.35,0; 8 8.89,0
09P = drill 0.914 long: 1 -10.16,0; 2 -7.62,0; 3 -5.08,0; 4 -2.54,0; 5 0,0; 6 2.54,0; 7 5.08,0; 8 7.62,0; 9 10.16,0
SOT23-3 = smd 0.8 x 0.9: 1 -0.95,-1; 2 0.95,-1; 3 0,1.1
TVS_6DIODE_ARRAY = drill 0.813 long: 1 -5.08,-3.81; 2 -2.54,-3.81; 3 0,-3.81; 4 2.54,-3.81; 5 2.54,3.81; 6 0,3.81; 7 -2.54,3.81; 8 -5.08,3.81
ADAFRUIT_AIRLIFT_ESP32 = drill 0.889: P$1 13.97,-11.43; P$2 11.43,-11.43; P$3 8.89,-11.43; P$4 6.35,-11.43; P$5 3.81,-11.43; P$6 1.27,-11.43; P$7 -1.27,-11.43; P$8 -3.81,-11.43; P$9 -6.35,-11.43; P$10 -8.89,-11.43; P$11 -11.43,-11.43; P$12 -13.97,-11.43 | hole 2.54: -12.7,16.51; 12.7,16.51
TEENSY_3.5_ALL_PINS = drill 0.965: 0 -7.62,27.94; 1 -7.62,25.4; 2 -7.62,22.86; 3 -7.62,20.32; 3.3V 7.62,25.4; 3.3V3 -7.62,-5.08; 3.3V4 -2.54,-15.24; 4 -7.62,17.78; 5 -7.62,15.24; 6 -7.62,12.7; 7 -7.62,10.16; 8 -7.62,7.62; 9 -7.62,5.08; 10 -7.62,2.54; 11 -7.62,0; 12 -7.62,-2.54; 13 7.62,-2.54; 14/A0 7.62,0; 15/A1 7.62,2.54; 16/A2 7.62,5.08; 17/A3 7.62,7.62; 18/A4 7.62,10.16; 19/A5 7.62,12.7; 20/A6 7.62,15.24; 21/A7 7.62,17.78; 22/A8 7.62,20.32; 23/A9 7.62,22.86; 24 -7.62,-7.62; 25 -7.62,-10.16; 26 -7.62,-12.7; 27 -7.62,-15.24; 28 -7.62,-17.78; 29 -7.62,-20.32; 30 -7.62,-22.86; 31/A12 -7.62,-25.4; 32/A13 -7.62,-27.94; 33/A14 7.62,-27.94; 34/A15 7.62,-25.4; 35/A16 7.62,-22.86; 36/A17 7.62,-20.32; 37/A18 7.62,-17.78; 38/A19 7.62,-15.24; 39/A20 7.62,-12.7; A10 5.08,20.32; A11 5.08,17.78; A21 7.62,-10.16; A22 7.62,-7.62; A25 -4.445,19.05; A26 -4.445,21.59; AGND 7.62,27.94; AREF 5.08,22.86; GND -7.62,30.48; GND1 7.62,-5.08; GND3 -4.445,16.51; GND4 -4.445,13.97; GND6 0,-15.24; NC -4.445,24.13; PGM 2.54,-15.24; RESET 5.08,-15.24; VBAT -5.08,-15.24; VIN 7.62,30.48; VUSB 5.08,27.94
TRIMBOT-BOURNS-3362M = drill 1.016 pad 1.88 square: 1 -2.54,-0.015 | drill 1.016 pad 1.88: 2 0,-0.015; 3 2.54,-0.015
LCD-CHARACTER-DISPLAY-20X4 = drill 0.965 pad 1.676 square: 1 10.159,57.082 | drill 0.965: 2 12.699,57.082; 3 15.239,57.082; 4 17.779,57.082; 5 20.319,57.082; 6 22.859,57.082; 7 25.399,57.082; 8 27.939,57.082; 9 30.479,57.082; 10 33.019,57.082; 11 35.559,57.082; 12 38.099,57.082; 13 40.639,57.082; 14 43.179,57.082; 15 45.719,57.082; 16 48.259,57.082 | hole 3.302: 2.54,2.54; 2.413,57.082; 95.24,57.59; 95.24,2.54

### Placement (x,y rotation side)
BT1  89.41,29.46 90 bottom
C1  12.7,104.14 90 bottom
C2  17.78,104.14 90 bottom
C3  22.86,104.14 90 bottom
C4  27.94,104.14 90 bottom
C5  26.54,46.23 90 bottom
C6  25.15,66.17 90 bottom
C7  33.02,104.14 90 bottom
C8  43.31,104.52 270 bottom
C9  59.69,99.06 270 bottom
C10  74.55,108.08 90 bottom
D1  23.11,78.74 270 bottom
D2  30.23,45.85 270 bottom
D3  29.97,67.06 270 bottom
F1  21.08,72.9 180 bottom
IC1  62.74,87.25 270 bottom
J1  10.67,66.04 90 bottom
K1  44.07,44.07 180 bottom
K2  44.32,70.36 180 bottom
L1  43.18,91.44 0 bottom
LED1  109.22,50.8 0 top
LED2  147.32,50.8 0 top
LED3  96.52,45.72 0 top
LED4  160.02,45.72 0 top
LED5  73.66,71.12 0 top
LED6  180.34,25.4 0 top
OK1  17.78,35.56 270 bottom
Q1  29.59,53.34 0 bottom
Q2  29.46,60.2 0 bottom
Q3  67.44,98.68 0 bottom
R1  38.1,111.76 270 bottom
R2  33.02,111.76 270 bottom
R3  17.78,111.76 90 bottom
R4  12.7,111.76 90 bottom
R5  48.26,111.76 90 bottom
R6  43.18,111.76 90 bottom
R7  125.22,43.69 90 bottom
R8  4.06,53.85 270 bottom
R9  27.94,111.76 90 bottom
R10  22.86,111.76 90 bottom
R11  24,54.1 90 bottom
R12  19.3,66.04 90 bottom
R13  130.3,43.69 90 bottom
R14  9.02,53.85 270 bottom
R15  120.14,43.69 90 bottom
R16  14.1,53.85 270 bottom
R17  43.94,57.53 270 bottom
R18  38.35,57.4 270 bottom
R19  135.38,43.69 90 bottom
R20  19.18,53.85 270 bottom
R21  48.64,104.39 270 bottom
R22  54.23,104.27 90 bottom
R23  54.1,111.76 270 bottom
R26  74.8,102.23 90 bottom
R28  61.09,73.53 90 bottom
R29  66.55,73.53 270 bottom
R30  162.56,25.4 90 bottom
R31  167.64,25.4 90 bottom
S1  180.34,33.02 0 top
S2  139.7,33.02 0 top
S3  114.3,33.02 0 top
S4  142.24,7.62 0 top
S5  162.56,7.62 0 top
S6  111.76,7.62 0 top
S7  91.44,7.62 0 top
SL1  7.87,85.6 90 bottom
SL2  8.13,34.54 90 bottom
T3  73.66,77.6 0 bottom
T4  172.72,25.4 0 bottom
U1  19.3,88.39 270 bottom
U2  17.78,12.7 270 bottom
U3  41.15,19.68 180 bottom
U4  68.58,36.32 180 bottom
VR1  66.17,108.33 0 bottom
X1  79.38,52.07 0 top

### Tracks (layer width: path | path; a pad name or v marks a point on that pad's centre or on a via)
3.3V  (via drill 0.35)
  Top 0.508: U4.3.3V3 66.04,46.48 U4.3.3V4 | U4.3.3V 73.91,10.92 72.14,12.7 72.14,30.23 v71.12,31.24
  Bottom 0.508: U4.3.3V3 v71.12,31.24
GND  (via drill 0.35)
  Top 0.508: S5.2 163.32,9.4 159.51,9.4 157.73,7.62 S4.2 144.78,9.4 | 144.78,9.4 144.78,30.48 S2.2 | U4.GND6 68.58,49.02 U4.GND1 | U4.GND4 64.26,22.35 64.26,19.81 U4.GND3 | S7.2 95.76,9.4 109.73,9.4 111.51,7.62 S6.2 116.08,9.4 144.78,9.4 | U4.AGND 88.9,21.08 89.41,21.08 BT1.2 | U2.4 22.61,11.18 22.86,11.18 32.13,20.45 | 32.13,20.45 32.26,20.57 U3.P$10 | v70.36,73.41 65.79,68.83 60.2,68.83 49.28,57.91 49.28,50.29 K1.P$3 | X1.5 99.57,109.22 98.04,110.74 91.19,110.74 89.66,109.22 X1.1 | 50.29,109.98 61.98,109.98 63.5,108.46 VR1.3 | 50.29,109.98 v45.21,109.98 39.37,109.98 v34.8,114.55 | 50.29,109.98 v50.29,109.47 | OK1.9 13.97,27.18 15.49,28.7 15.49,32.77 OK1.12 OK1.13 | SL2.7 SL2.8 7.62,42.16 5.84,43.94 5.84,52.32 9.14,55.63 9.14,65.53 8.13,66.55 7.7,64.77 | U1.4 23.11,84.07 26.92,80.26 D1.1 26.92,80.01 36.32,80.01 39.88,76.45 49.28,76.45 K2.P$3 | 7.62,76.71 7.37,76.71 5.59,78.49 5.59,80.01 7.37,81.79 SL1.3 7.11,81.79 5.59,83.31 5.59,85.09 7.37,86.87 SL1.5 | 7.62,76.71 7.62,67.82 J1.P$5 | 7.62,76.71 SL1.1 | U4.GND 60.45,5.84 45.97,20.32 32.26,20.32 32.13,20.45
  Bottom 0.508: 165.99,28.07 169.16,31.24 181.1,31.24 S1.2 | 165.99,28.07 165.86,27.94 165.86,22.86 166.37,22.35 168.91,22.35 170.94,24.38 171.7,24.38 T4.2 | S3.2 134.87,33.02 136.65,34.8 140.46,34.8 S2.2 159.26,33.02 164.08,28.19 165.86,28.19 165.99,28.07 | U4.GND 65.79,10.67 65.79,18.03 | 65.79,18.03 65.79,18.29 64.26,19.81 U4.GND3 | 65.79,18.03 70.1,18.03 70.87,17.27 70.87,13.72 U4.AGND 76.2,8.64 76.96,9.4 89.41,9.4 91.19,7.62 S7.2 | U4.GND1 73.41,38.61 73.41,29.97 65.79,22.35 U4.GND4 | IC1.GND 65.28,87.12 59.69,87.12 49.53,76.96 49.53,76.45 K2.P$3 49.28,76.2 38.73,65.66 | C5.2 26.67,47.75 27.94,49.02 27.94,51.31 Q1.3 27.94,51.56 27.94,52.83 27.69,53.09 27.69,56.13 27.94,56.39 27.94,58.17 Q2.3 27.94,58.42 27.43,58.93 27.43,65.79 27.3,65.91 | 27.3,65.91 25.65,67.56 25.15,67.56 C6.2 | 40.13,56.13 R17.2 43.94,55.37 46.61,52.7 | 40.13,56.13 38.35,56.13 R18.2 | v70.36,73.41 72.64,75.69 72.64,76.45 T3.2 | 46.61,52.7 49.02,50.29 K1.P$3 | 38.73,65.66 40.13,64.26 40.13,56.13 | 38.73,65.66 37.34,67.06 29.21,67.06 28.19,66.04 27.43,66.04 27.3,65.91 | 46.61,52.7 41.15,47.24 41.15,39.37 37.85,36.07 37.59,36.07 32.77,31.24 32.26,31.24 U3.P$10 | 50.29,107.44 52.58,107.44 54.1,105.92 R22.2 54.36,105.66 56.13,103.89 56.13,100.84 59.18,97.79 59.69,97.79 C9.2 | 50.29,107.44 47.24,107.44 46.74,106.93 46.74,106.43 43.43,103.12 C8.2 | C7.2 33.02,105.16 38.1,105.16 43.18,110.24 R6.1 43.18,109.98 v45.21,109.98 | VR1.3 63.75,108.2 65.53,106.43 69.85,106.43 72.39,108.97 74.42,108.97 C10.2 74.68,108.97 75.95,108.97 80.01,104.9 85.34,104.9 89.41,108.97 X1.1 | X1.16 127.51,109.22 125.98,110.74 101.35,110.74 99.82,109.22 X1.5
  Bottom 0.508: v50.29,109.47 50.29,107.44 | 19.56,108.71 21.34,108.71 22.86,110.24 R10.1 | 19.56,108.71 17.27,108.71 13.72,105.16 12.7,105.16 C1.2 | 19.18,114.68 19.56,114.3 19.56,108.71 | 19.18,114.68 19.05,114.81 11.43,114.81 10.92,114.3 10.92,112.01 11.43,111.51 11.68,111.51 12.7,110.49 R4.1 12.7,109.22 8.64,105.16 8.64,99.82 4.57,95.76 4.57,84.58 7.37,81.79 SL1.3 | 33.02,113.28 30.73,113.28 29.21,114.81 19.3,114.81 19.18,114.68 | OK1.16 10.92,44.45 8.64,42.16 SL2.8 | OK1.13 11.43,36.83 8.64,39.62 SL2.7 | 22.86,105.16 17.78,105.16 C2.2 17.78,104.9 17.02,104.9 16,103.89 16,99.31 8.64,91.95 SL1.7 8.38,91.95 10.16,90.17 10.16,88.65 8.38,86.87 SL1.5 | 22.86,105.16 27.94,105.16 C4.2 | 22.86,105.16 C3.2 | U1.4 22.35,85.85 13.21,76.71 SL1.1 | v34.8,114.55 34.29,114.55 33.02,113.28 | 33.02,113.28 R2.1
  pour Bottom: 0,116.84 0,0 190.5,0 190.5,116.84
  pour Top: 0,116.84 0,0 190.5,0 190.5,116.84
N$1  (via drill 0.35)
  Top 0.508: U4.VBAT 63.5,53.85 75.44,65.79 76.96,65.79 86.61,56.13 v86.61,44.7
  Bottom 0.508: v86.61,44.7 86.61,44.2 89.41,41.4 BT1.1
N$2
  Bottom 0.508: Q1.2 29.72,53.34 29.72,54.36 Q1.2@1 29.46,53.34 29.46,48.26 28.96,47.75 28.96,45.97 30.23,44.7 D2.A 30.23,44.45 36.83,37.85 K1.P$5
N$3
  Top 0.508: U4.0 65.02,8.38 72.14,1.27 82.55,1.27 S7.1
N$4
  Bottom 0.508: LED1.A 107.95,49.53 116.84,40.64 121.41,40.64 121.92,41.15 121.92,41.91 123.95,43.94 124.21,43.94 125.22,44.96 R7.2
N$5
  Top 0.508: U1.5 14.48,86.87 14.22,86.87 10.16,90.93 10.16,92.71 8.38,94.49 SL1.8
  Bottom 0.508: SL1.8 8.38,94.49 14.99,101.09 14.99,104.9 16.76,106.68 22.1,106.68 25.65,110.24 27.94,110.24 R9.1
N$6
  Bottom 0.508: 29.97,64.52 29.97,61.98 29.46,61.47 Q2.2 Q2.2@1 | 29.97,64.52 D3.A | 29.97,64.52 37.08,64.52 K2.P$5
N$7
  Bottom 0.508: U3.P$1 55.12,38.35 59.44,42.67 59.44,60.2 U4.31/A12
N$8  (via drill 0.35)
  Top 0.508: v16.76,24.64 16.76,38.1 16.51,38.35 16.51,48.26 16.26,48.51 16.26,49.53 17.02,50.29 18.03,50.29 18.16,50.16 | 18.16,50.16 20.07,48.26 20.07,40.89 OK1.3 | SL2.5 7.62,34.54 4.83,31.75 v4.83,20.57 | LED2.K 130.81,68.58 109.73,68.58 97.54,80.77 81.79,80.77 v77.98,84.58 | v55.37,76.2 54.86,76.2 33.27,54.61 22.61,54.61 18.16,50.16
  Bottom 0.508: U2.2 20.57,16.26 20.32,16.26 18.29,18.29 18.29,19.3 | 18.29,19.3 18.29,23.11 v16.76,24.64 | v4.83,20.57 4.83,17.53 8.64,13.72 8.64,11.18 12.19,7.62 23.37,7.62 24.89,9.14 24.89,17.27 22.86,19.3 18.29,19.3 | v77.98,84.58 69.6,84.58 61.72,76.71 55.88,76.71 v55.37,76.2
N$9
  Top 0.508: F1.1 16,67.56 14.22,65.79 J1.P$1 13.46,64.26 13.46,58.42 8.13,53.09 SL2.9
N$10
  Bottom 0.508: LED2.A 138.18,50.8 132.59,45.21 130.3,45.21 R13.2
N$11
  Top 0.508: U2.7 12.95,16.26 12.7,16.26 8.13,20.83 SL2.1 8.64,24.38 11.18,26.92 11.18,47.5 34.04,70.36 K2.P$1
  Bottom 0.508: K2.P$1 24.38,70.36 21.59,67.56 19.3,67.56 R12.2
N$12  (via drill 0.35)
  Top 0.508: 33.91,45.09 35.05,43.94 K1.P$1 | 33.91,45.09 v26.67,52.32 | v19.05,13.21 19.05,13.46 19.3,13.72 19.3,20.83 v26.67,28.19 | 33.91,45.09 v24.38,35.56
  Bottom 0.508: U2.6 14.99,13.72 15.24,13.72 16.13,14.61 | 16.13,14.61 16.26,14.73 16.26,19.3 8.64,26.92 SL2.2 | v26.67,52.32 26.67,53.34 24.64,55.37 24.13,55.37 R11.2 | v19.05,13.21 17.78,14.48 16.26,14.48 16.13,14.61 | v26.67,28.19 26.67,29.46 24.38,31.75 v24.38,35.56
N$13  (via drill 0.35)
  Top 0.508: v114.3,44.96 99.31,44.96 98.3,43.94 97.03,43.94 LED3.A
  Bottom 0.508: v114.3,44.96 120.14,44.96 R15.2
N$14  (via drill 0.35)
  Top 0.508: U4.24 47.5,43.94 45.47,41.91 v39.88,41.91
  Bottom 0.508: 36.58,58.42 38.1,58.42 38.35,58.67 R18.1 | 36.58,58.42 30.99,58.42 Q2.1 | v39.88,41.91 39.88,51.56 36.58,54.86 36.58,58.42
N$15
  Bottom 0.508: 29.72,108.71 29.72,111.51 27.94,113.28 | 29.72,108.71 29.72,104.39 28.7,103.38 27.94,103.38 C4.1 | 27.94,113.28 22.86,113.28 R10.2 | 27.94,113.28 R9.2 | U4.15/A1 88.14,33.78 101.09,46.74 101.09,63.25 130.3,92.46 130.3,110.24 124.97,115.57 37.59,115.57 34.8,112.78 34.8,109.22 34.29,108.71 29.72,108.71
N$16
  Top 0.508: SL1.6 7.37,89.41 5.59,91.19 5.59,95.25 6.35,96.01 23.37,96.01 25.4,93.98 25.4,90.42 23.37,88.39 U1.3
  Bottom 0.508: U1.3 23.37,88.39 25.4,90.42 25.4,90.93 42.16,107.7 44.7,107.7 47.24,110.24 48.26,110.24 R5.1
N$17  (via drill 0.35)
  Top 0.508: v26.16,103.38 34.04,103.38 v39.12,108.46 | v102.36,62.74 102.36,72.64 v96.52,78.49 | v60.2,102.62 v79.5,102.62
  Bottom 0.508: v26.16,103.38 22.86,103.38 C3.1 | v39.12,108.46 41.4,110.74 41.4,111.51 43.18,113.28 | 43.18,113.28 48.26,113.28 | 43.18,113.28 R6.2 | U4.16/A2 87.12,31.24 102.11,46.23 102.11,62.48 v102.36,62.74 | v96.52,78.49 96.52,85.6 v79.5,102.62 | v60.2,102.62 54.1,108.71 52.83,108.71 48.26,113.28 | 48.26,113.28 R5.2
N$18
  Top 0.508: U1.2 22.1,89.92 21.84,89.92 17.78,85.85 17.78,85.34 16.76,84.33 SL1.4
  Bottom 0.508: SL1.4 7.37,84.33 5.59,86.11 5.59,95.25 9.65,99.31 9.65,104.65 11.43,106.43 11.68,106.43 15.49,110.24 17.78,110.24 R3.1
N$19  (via drill 0.35)
  Top 0.508: v17.27,101.6 15.49,101.6 14.22,100.33 13.21,100.33 12.45,101.09 12.45,109.73 v14.48,111.76 | U4.17/A3 87.38,39.88 87.38,43.69 91.44,47.75 91.44,60.71 v77.72,74.42 | v77.72,78.99 59.69,78.99 58.17,77.47 54.61,77.47 50.55,73.41 28.45,73.41 20.07,81.79 15.75,81.79 v14.48,83.06
  Bottom 0.508: C2.1 17.78,102.11 v17.27,101.6 17.27,99.06 13.21,95 13.21,85.34 14.48,84.07 v14.48,83.06 | R4.2 12.7,113.03 13.21,113.03 v14.48,111.76 14.48,112.01 15.49,113.03 17.78,113.03 R3.2 | v77.72,78.99 v77.72,74.42
N$20
  Bottom 0.508: LED4.A 158.24,45.21 135.38,45.21 R19.2
N$21  (via drill 0.35)
  Top 0.508: OK1.5 21.59,34.8 17.53,38.86 v17.53,49.02
  Bottom 0.508: v17.53,49.02 14.22,52.32 R16.2
N$22
  Bottom 0.508: R1.1 38.1,113.03 37.08,112.01 36.83,112.01 35.81,111 35.81,108.71 33.78,106.68 32,106.68 30.73,105.41 30.73,101.09 U1.1 23.11,93.73 20.83,91.44 20.83,85.85 14.22,79.25 SL1.2
N$23
  Bottom 0.508: T4.1 173.48,24.38 172.97,23.88 172.97,23.62 170.69,21.34 165.1,21.34 162.56,23.88 R30.1
N$24
  Top 0.508: LED1.K 110.49,52.83 95.76,67.56 95.76,75.69 92.71,78.74 79.25,78.74 78.23,77.72 59.94,77.72 49.53,67.31 47.5,67.31 33.78,53.59 26.16,53.59 24.38,51.82 24.38,43.69 22.61,41.91 OK1.2
  Bottom 0.508: U2.1 22.61,16.76 22.86,16.76 23.88,15.75 23.88,9.65 22.86,8.64 12.7,8.64 9.65,11.68 9.65,18.29 4.57,23.37 4.57,36.32 5.33,37.08 5.84,37.08 | SL2.6 5.84,37.08 | OK1.2 18.54,41.91 14.22,46.23 6.6,46.23 5.84,45.47 5.84,37.08
N$25  (via drill 0.35)
  Top 0.508: v13.72,101.6 22.1,109.98 v30.99,109.98 32.51,108.46 v37.08,108.46 | v131.57,109.22 125.22,115.57 43.43,115.57 v40.13,112.27
  Bottom 0.508: C1.1 12.7,102.62 v13.72,101.6 | v30.99,109.98 32.77,109.98 33.02,110.24 R2.2 | 38.1,110.24 38.1,109.47 v37.08,108.46 | U4.18/A4 83.57,26.16 103.12,45.72 103.12,61.72 131.57,90.17 v131.57,109.22 | 38.1,110.24 v40.13,112.27 | 38.1,110.24 R1.2
N$26  (via drill 0.35)
  Top 0.508: v56.9,7.62 60.2,4.32 61.72,4.32 v64.52,7.11 | v69.6,16.76 69.6,32.26 U4.13
  Bottom 0.508: U3.P$9 34.8,29.72 v56.9,7.62 | v64.52,7.11 64.52,7.87 69.6,12.95 v69.6,16.76
N$27
  Top 0.508: U4.12 58.17,36.07 42.67,36.07 37.85,31.24 37.34,31.24 U3.P$8
N$28
  Top 0.508: U4.11 59.69,35.05 44.2,35.05 40.39,31.24 39.88,31.24 U3.P$7
N$29  (via drill 0.35)
  Top 0.508: v42.42,46.74 42.42,52.83 52.83,63.25 52.83,63.5 65.02,75.69 80.77,75.69 89.66,66.8 v93.47,66.8 | v104.39,56.13 v96.01,64.52
  Bottom 0.508: v42.42,46.74 U3.P$6 | v93.47,66.8 95.76,64.52 v96.01,64.52 | v104.39,56.13 104.39,45.47 82.55,23.62 U4.19/A5
N$30  (via drill 0.35)
  Top 0.508: v44.96,43.18 58.42,56.64 58.42,65.53 60.71,67.82 77.98,67.82 90.17,55.63 v90.17,48.26 | v91.44,41.91 91.44,36.32 U4.20/A6
  Bottom 0.508: v44.96,43.18 U3.P$5 | v90.17,48.26 90.17,43.18 v91.44,41.91
N$31
  Bottom 0.508: U3.P$4 47.5,22.35 59.44,10.41 59.44,5.08 61.21,3.3 81.03,3.3 83.82,6.1 88.14,6.1 88.39,5.84 94.49,5.84 95.76,7.11 95.76,8.13 85.34,18.54 U4.21/A7
N$32
  Bottom 0.508: U3.P$2 52.58,37.34 56.9,41.66 56.9,60.2 U4.32/A13
N$33  (via drill 0.35)
  Top 0.508: U4.34/A15 77.72,60.2 77.72,52.83 80.26,50.29 v85.34,50.29 | v122.43,96.52 122.43,108.97 X1.14
  Bottom 0.508: v85.34,50.29 96.77,61.72 96.77,61.98 106.93,72.14 106.93,81.03 v122.43,96.52
N$34
  Bottom 0.508: T4.3 172.72,26.42 170.43,26.42 168.15,24.13 167.64,24.13 R31.1
N$35
  Bottom 0.508: U4.39/A20 82.3,49.02 105.92,72.64 105.92,81.79 129.29,105.16 129.29,109.73 127.25,111.76 99.82,111.76 97.28,109.22 X1.4
N$36  (via drill 0.35)
  Top 0.508: v79.76,69.85 v76.2,69.85 | v90.93,84.58 91.44,84.58 102.11,95.25 102.11,108.97 X1.6
  Bottom 0.508: U4.38/A19 74.68,53.09 74.68,68.33 v76.2,69.85 | v79.76,69.85 90.93,81.03 v90.93,84.58
N$37  (via drill 0.35)
  Top 0.508: v25.91,25.65 25.91,16.76 21.84,12.7 U2.3 | v108.2,76.45 101.35,83.31 81.03,83.31 78.49,85.85 v76.71,85.85 | v51.31,63.5 39.12,51.31 39.12,45.47 28.19,34.54 25.15,34.54 24.38,33.78 24.38,33.53 22.61,31.75 OK1.6
  Bottom 0.508: U2.3 20.57,13.72 20.32,13.72 17.27,16.76 17.27,19.81 10.41,26.67 10.41,30.23 8.64,32 SL2.4 | OK1.6 22.61,31.75 25.4,28.96 25.4,26.16 v25.91,25.65 | LED3.K 97.79,61.47 108.2,71.88 v108.2,76.45 | v76.71,85.85 69.34,85.85 65.53,82.04 56.13,82.04 51.31,77.22 v51.31,63.5
N$38  (via drill 0.35)
  Top 0.508: v114.81,102.36 v114.81,92.46
  Bottom 0.508: U4.37/A18 77.72,55.63 77.72,56.64 88.9,67.82 88.9,68.58 96.52,76.2 98.55,76.2 v114.81,92.46 | v114.81,102.36 114.81,108.97 X1.11
N$39
  Bottom 0.508: U4.36/A17 87.88,68.33 87.88,69.09 96.01,77.22 97.79,77.22 117.35,96.77 117.35,108.97 X1.12
N$40  (via drill 0.35)
  Top 0.508: v95.25,84.58 119.89,109.22 X1.13
  Bottom 0.508: U4.35/A16 95.25,78.23 v95.25,84.58
N$41  (via drill 0.35)
  Top 0.508: v35.56,51.56 v41.91,57.91 41.91,59.69 48.51,66.29 50.04,66.29 60.45,76.71 81.53,76.71 v90.17,68.07 | U4.23/A9 92.71,29.97 v92.71,65.53
  Bottom 0.508: v35.56,51.56 31.24,51.56 Q1.1 | v41.91,57.91 42.93,57.91 R17.1 | v90.17,68.07 v92.71,65.53
N$42  (via drill 0.35)
  Top 0.508: v5.84,35.81 5.84,42.42 4.83,43.43 4.83,53.09 v6.86,55.12 | v123.7,53.09 97.03,79.76 81.03,79.76 71.12,89.66 65.28,89.66 IC1.IN
  Bottom 0.508: v5.84,35.81 5.84,23.62 11.68,17.78 U2.8 | R8.1 4.06,55.12 v6.86,55.12 8.89,55.12 R14.1 9.14,55.37 13.97,55.37 R16.1 14.22,55.37 17.02,55.37 | 17.02,55.37 19.05,55.37 R20.1 | 123.83,46.61 123.95,46.74 126.49,46.74 127,46.23 127,43.94 126.87,43.81 | 123.83,46.61 123.44,46.23 123.44,45.47 121.41,43.43 121.16,43.43 120.14,42.42 R15.1 | 126.87,43.81 125.22,42.16 R7.1 | 130.3,42.42 128.27,42.42 126.87,43.81 | 130.3,42.42 135.38,42.42 R19.1 | 130.3,42.42 R13.1 | 41.53,101.98 42.16,101.35 44.45,101.35 46.74,103.63 46.74,104.14 48.51,105.92 R21.1 48.77,105.92 50.55,104.14 50.55,102.11 62.74,89.92 65.28,89.92 IC1.IN | 41.53,101.98 41.4,102.11 41.4,104.14 43.18,105.92 C8.1 | 41.53,101.98 30.99,91.44 L1.P$2 25.4,87.63 25.4,79.5 17.02,71.12 17.02,55.37 | v123.7,53.09 123.7,46.74 123.83,46.61
N$43  (via drill 0.35)
  Top 0.508: U4.1 62.48,9.4 65.53,9.4 72.64,2.29 81.79,2.29 v84.33,4.83
  Bottom 0.508: v84.33,4.83 106.43,4.83 S6.1
N$44  (via drill 0.35)
  Top 0.508: U4.2 58.17,10.67 v58.17,9.91
  Bottom 0.508: v58.17,9.91 58.17,4.83 60.71,2.29 154.69,2.29 S5.1
N$45  (via drill 0.35)
  Top 0.508: U4.3 62.48,17.53 62.48,22.86 63.5,23.88 64.77,23.88 68.33,20.32 68.33,9.65 73.66,4.32 80.52,4.32 88.14,11.94 v114.3,11.94
  Bottom 0.508: v114.3,11.94 135.38,11.94 S4.1
N$46  (via drill 0.35)
  Top 0.508: v54.61,42.67 v57.91,39.37 | v64.52,71.63 66.8,71.63 69.85,74.68 74.68,74.68 v74.93,74.42 | v84.58,82.04 100.84,82.04 v113.03,69.85
  Bottom 0.508: U4.4 57.91,21.59 v57.91,39.37 | v54.61,42.67 54.61,61.72 v64.52,71.63 | v74.93,74.42 76.45,75.95 76.45,79.5 78.99,82.04 v84.58,82.04 | v113.03,69.85 113.03,58.17 106.17,51.31 106.17,38.61 S3.1
N$47  (via drill 0.35)
  Top 0.508: v63.25,10.67 65.79,10.67 73.15,3.3 81.03,3.3 88.39,10.67 114.81,10.67 S2.1
  Bottom 0.508: U4.5 62.48,19.56 62.48,11.43 v63.25,10.67
N$48
  Bottom 0.508: X1.3 94.49,109.22 94.49,112.01 91.95,114.55 71.88,114.55 66.29,108.97 66.29,108.46 VR1.2
N$49  (via drill 0.35)
  Top 0.508: v52.32,111.76 78.49,111.76 v80.01,113.28 | v91.44,113.28 120.9,113.28 124.97,109.22 X1.15
  Bottom 0.508: v52.32,111.76 53.59,110.49 54.1,110.49 R23.2 | v91.44,113.28 v80.01,113.28
N$50  (via drill 0.35)
  Top 0.508: U4.25 59.44,48.01 59.44,65.02 61.21,66.8 77.47,66.8 88.9,55.37 v88.9,50.29 | v96.52,50.29 105.41,50.29 v109.22,46.48
  Bottom 0.508: v96.52,50.29 v88.9,50.29 | v109.22,46.48 119.89,35.81 175.01,35.81 S1.1
N$51
  Bottom 0.508: LED5.K 77.72,71.12 85.85,79.25 85.85,82.55 85.09,83.31 70.36,83.31 62.23,75.18 61.21,75.18 R28.2
N$52  (via drill 0.35)
  Top 0.508: v40.89,21.84 59.18,21.84 U4.6
  Bottom 0.508: OK1.10 21.34,21.84 v40.89,21.84
N$53  (via drill 0.35)
  Top 0.508: v15.49,35.56 15.49,47.75 15.24,48.01 15.24,50.04 21.08,55.88 v31.75,55.88 | v34.8,52.83 34.29,52.32 34.29,47.5 v35.56,46.23 | v39.88,40.13 55.37,40.13 57.4,38.1 58.42,38.1 59.44,39.12 v59.44,39.88
  Bottom 0.508: OK1.11 13.97,32.26 15.49,33.78 v15.49,35.56 | v34.8,52.83 v31.75,55.88 | v35.56,46.23 38.61,43.18 38.61,41.4 v39.88,40.13 | v59.44,39.88 59.44,27.69 U4.7
N$54  (via drill 0.35)
  Top 0.508: v39.62,23.11 55.37,23.11 U4.8
  Bottom 0.508: OK1.14 13.97,38.86 19.05,33.78 19.05,25.65 21.59,23.11 v39.62,23.11
N$55  (via drill 0.35)
  Top 0.508: v38.35,24.38 54.1,24.38 U4.9
  Bottom 0.508: OK1.15 13.97,41.4 20.07,35.31 20.07,26.16 21.84,24.38 v38.35,24.38
N$56
  Bottom 0.508: R11.1 23.88,52.58 23.88,52.07 21.84,50.04 21.84,49.02 25.91,44.96 26.42,44.96 C5.1
N$57
  Bottom 0.508: R12.1 19.3,64.77 25.15,64.77 C6.1
N$58
  Bottom 0.508: OK1.1 17.53,44.45 12.45,49.53 6.86,49.53 4.06,52.32 R8.2
N$59
  Top 0.508: OK1.7 18.29,25.91 18.29,14.22 15.24,11.18 14.99,11.18 U2.5 13.97,10.41 13.46,10.41 11.68,12.19 11.68,15.49 6.73,20.45 | SL2.3 7.62,29.46 5.84,27.69 5.84,21.34 6.73,20.45 | LED4.K 161.29,77.72 124.46,114.55 90.93,114.55 85.85,109.47 85.85,101.35 76.96,92.46 63.5,92.46 57.91,86.87 57.91,80.26 57.15,79.5 43.69,79.5 26.16,97.03 5.84,97.03 3.56,94.74 3.56,20.07 4.32,19.3 5.59,19.3 6.73,20.45
N$60  (via drill 0.35)
  Top 0.508: v18.8,45.72 18.8,39.62 OK1.4
  Bottom 0.508: v18.8,45.72 13.97,50.55 12.7,50.55 10.92,52.32 9.14,52.32 R14.2
N$61
  Bottom 0.508: LED6.K 179.07,27.94 170.43,27.94 169.42,26.92 167.64,26.92 R31.2
N$62  (via drill 0.35)
  Top 0.508: OK1.8 22.61,26.67 25.65,29.72 v25.65,33.27 | v25.65,49.53 v25.65,42.93 | v23.11,49.53 23.11,50.04 v21.59,51.56
  Bottom 0.508: v25.65,42.93 v25.65,33.27 | v23.11,49.53 v25.65,49.53 | v21.59,51.56 20.07,51.56 19.3,52.32 R20.2
N$63  (via drill 0.35)
  Top 0.508: v35.81,103.12 45.47,103.12 v46.74,101.85 46.74,102.11 47.24,102.62 v51.82,102.62 | v94.74,57.91 94.74,74.93 v92.2,77.47 | v56.39,98.81 v81.53,98.81
  Bottom 0.508: v35.81,103.12 33.02,103.12 C7.1 | v46.74,101.85 47.5,101.85 48.51,102.87 R21.2 | v51.82,102.62 54.1,102.62 R22.1 54.1,102.36 54.1,101.09 v56.39,98.81 | U4.14/A0 87.63,47.75 87.63,50.8 v94.74,57.91 | v92.2,77.47 92.2,88.14 v81.53,98.81
N$64
  Bottom 0.508: Q3.1 69.09,96.77 69.09,98.04 74.68,103.63 R26.2 74.93,103.63 86.87,91.69 86.87,78.74 76.2,68.07 U4.33/A14
N$65
  Bottom 0.508: U3.P$3 50.04,36.32 55.88,42.16 55.88,61.47 60.2,65.79 61.72,65.79 62.48,65.02 62.48,60.71 U4.30
N$66
  Bottom 0.508: T3.1 74.42,76.45 74.42,75.69 70.87,72.14 69.6,72.14 66.55,75.18 R29.1
N$67
  Bottom 0.508: T3.3 73.66,78.49 67.06,78.49 62.99,74.42 62.99,73.91 61.21,72.14 R28.1
N$68
  Bottom 0.508: R29.2 66.55,57.15 U4.27
N$70
  Top 0.508: F1.2 23.62,72.9 19.3,77.22 D1.2
  Bottom 0.508: L1.P$1 44.7,91.44 F1.2
N$72  (via drill 0.35)
  Top 0.508: v79.76,7.11 v99.31,26.67 | v73.15,6.6 70.87,8.89 v70.87,29.21
  Bottom 0.508: v99.31,26.67 162.56,26.67 R30.2 | v79.76,7.11 76.96,4.32 75.44,4.32 v73.15,6.6 | v70.87,29.21 72.39,30.73 72.39,37.59 U4.26
VCC  (via drill 0.35)
  Top 0.508: v78.99,80.01 78.49,80.01 73.91,84.58 65.28,84.58 | v16.26,83.06 21.08,83.06 27.69,76.45 37.08,76.45 K2.P$2 37.34,76.2 39.12,74.42 50.04,74.42 54.1,78.49 57.66,78.49 63.63,84.46 | v34.04,68.33 v34.04,57.15 | 65.28,84.58 63.75,84.58 63.63,84.46 | 65.28,84.58 IC1.OUT | U4.VIN 80.52,5.84 109.47,34.8 150.37,34.8 | 150.37,34.8 169.67,34.8 LED6.A | v96.52,91.44 64.01,91.44 62.99,90.42 62.99,86.61 63.5,86.11 63.5,84.58 63.63,84.46 | v110.24,91.44 150.37,51.31 150.37,34.8
  Bottom 0.508: C9.1 59.69,100.33 60.2,100.33 63.75,96.77 65.79,96.77 Q3.3 66.04,96.52 66.04,95.5 66.55,95 67.56,95 | 67.56,95 69.6,95 74.68,100.08 74.68,100.58 R26.1 | 67.56,95 67.56,86.61 65.79,84.84 65.28,84.84 IC1.OUT | LED5.A 74.42,73.15 78.23,73.15 78.99,73.91 v78.99,80.01 | D2.C 30.23,47.24 34.04,47.24 36.83,50.04 K1.P$2 36.83,50.29 36.83,53.09 34.04,55.88 v34.04,57.15 | D3.C v34.04,68.33 36.07,68.33 37.34,69.6 37.34,76.2 K2.P$2 | U1.8 16.51,92.46 16.76,92.46 17.78,91.44 17.78,84.58 v16.26,83.06 | v110.24,91.44 v96.52,91.44
VDD  (via drill 0.35)
  Top 0.508: v46.99,55.63 46.99,49.53 42.93,45.47 41.4,45.47 27.18,31.24 U3.P$12 | v56.64,80.77 56.64,89.41 55.12,90.93 55.12,99.31 61.85,106.05 | 61.85,106.05 62.23,106.43 66.8,106.43 68.58,108.2 VR1.1 | v61.72,106.17 61.85,106.05
  Bottom 0.508: 67.56,100.08 74.42,106.93 C10.1 74.68,106.93 77.72,103.89 87.12,103.89 91.19,107.95 91.19,108.2 91.95,108.97 X1.2 | R23.1 54.1,113.03 54.86,113.03 v61.72,106.17 67.56,100.33 Q3.2 67.56,100.08 | 67.56,100.08 Q3.2@1 | v46.99,55.63 46.99,57.4 54.1,64.52 54.1,78.23 v56.64,80.77

### Text on the board
tPlace: L. Shustek / Oct 2019 / version 1.4 | Cummins generator control
bPlace: voltage and / current sense | L. Shustek / Oct 2019 / version 1.4 | control / status | Cummins generator control | Teensy 3.5 processor
Document: WiFi / connected | generator | utility | menu | generator / start/stop